# Altium schematic sheet Power Center.SchDoc
size A4
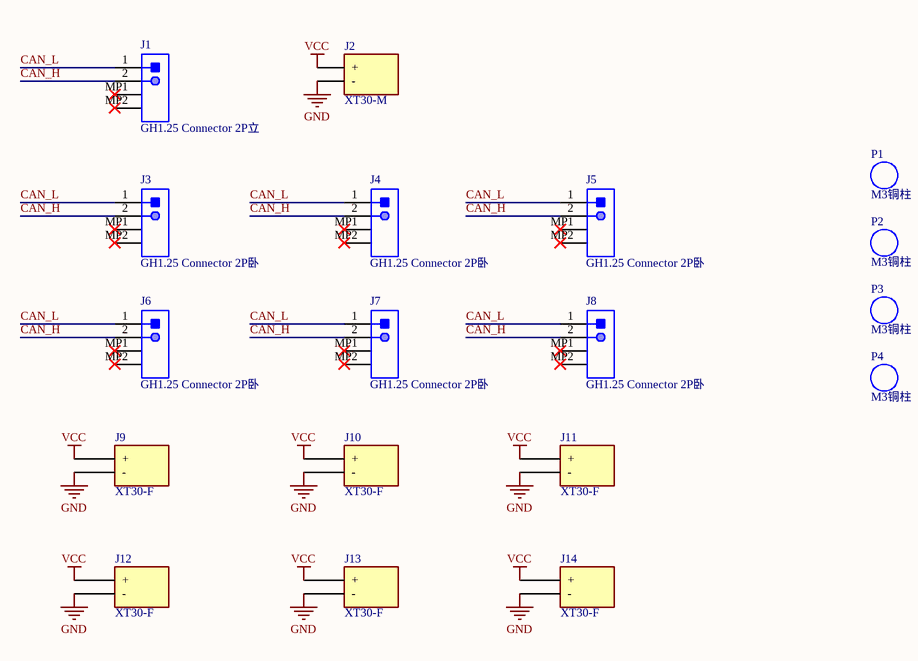
[diagram p0: Power Center.SchDoc]

## Parts
J1  GH1.25 Connector 2P立  [GH1.25立2P]
J2  XT30-M  [XT30-M]
J3  GH1.25 Connector 2P卧  [GH1.25卧2P]
J4  GH1.25 Connector 2P卧  [GH1.25卧2P]
J5  GH1.25 Connector 2P卧  [GH1.25卧2P]
J6  GH1.25 Connector 2P卧  [GH1.25卧2P]
J7  GH1.25 Connector 2P卧  [GH1.25卧2P]
J8  GH1.25 Connector 2P卧  [GH1.25卧2P]
J9  XT30-F  [XT30-F]
J10  XT30-F  [XT30-F]
J11  XT30-F  [XT30-F]
J12  XT30-F  [XT30-F]
J13  XT30-F  [XT30-F]
J14  XT30-F  [XT30-F]
P1  M3铜柱  [M3x4+6铜柱]
P2  M3铜柱  [M3x4+6铜柱]
P3  M3铜柱  [M3x4+6铜柱]
P4  M3铜柱  [M3x4+6铜柱]

## Nets
GND: J2.2(-) J9.2(-) J10.2(-) J11.2(-) J12.2(-) J13.2(-) J14.2(-)
VCC: J2.1(+) J9.1(+) J10.1(+) J11.1(+) J12.1(+) J13.1(+) J14.1(+)
CAN_H: J1.2 J3.2 J4.2 J5.2 J6.2 J7.2 J8.2
CAN_L: J1.1 J3.1 J4.1 J5.1 J6.1 J7.1 J8.1

Not connected (* = marked no-connect by the designer): J1 MP1* MP2*; J3 MP1* MP2*; J4 MP1* MP2*; J5 MP1* MP2*; J6 MP1* MP2*; J7 MP1* MP2*; J8 MP1* MP2*

## Library data of the parts
J1 = GH1.25 Connector 2P立: GH1.25 Connector; Manufacturer: JST; No of Positions: 2; Pitch: 1.25mm; Style/Orientation: StraightHeader/Plug; Package Reference: BM02B-GHS-TBT; Type: WiretoBoard; Datasheet URL: http://www.jst-mfg.com/product/pdf/eng/eGH.pdf; Termination: Crimp; Manufacturer URL: http://www.jst.com/home2.html; Mounting Technology: SurfaceMount; Datasheet Version: 05/2016; Package Description: GH Disconnectable Crimp Style Connector, Pitch 1.25 mm, 1 x 2 Position, Height 4.05 mm
J2 = XT30-M: Connector; Manufacturer_Name: Amass; Manufacturer_Part_Number: XT30PB; Datasheet Link: https://www.tme.eu/Document/4acc913878197f8c2e30d4b8cdc47230/XT30UPB%20SPEC.pdf; Height: 10.7mm
J3-J8 = GH1.25 Connector 2P卧: GH1.25 Connector; Manufacturer: JST; No of Positions: 2; Pitch: 1.25mm; Style/Orientation: RightAngleHeader/Plug; Package Reference: SM02B-GHS-TB; Type: WiretoBoard; Datasheet URL: http://www.jst-mfg.com/product/pdf/eng/eGH.pdf; Termination: Crimp; Manufacturer URL: http://www.jst.com/home2.html; Mounting Technology: SurfaceMount; Datasheet Version: 05/2016; Package Description: GH Disconnectable Crimp Style Connector, Pitch 1.25 mm, 1 x 2 Position, Height 4.25 mm
J9-J14 = XT30-F: Connector
P1-P4 = M3铜柱: Hole M3X4+6